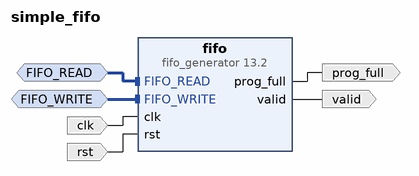
[diagram p0: block diagram of the top level]
# Vivado block design simple_fifo, xc7a35ticsg324-1L, Vivado 2020.1
create_bd_design simple_fifo

create_bd_intf_port -mode Slave -vlnv xilinx.com:interface:fifo_write_rtl:1.0 FIFO_WRITE
create_bd_intf_port -mode Slave -vlnv xilinx.com:interface:fifo_read_rtl:1.0 FIFO_READ
create_bd_port -dir I -type clk clk
set_property -dict {CONFIG.FREQ_HZ 100000000} [get_bd_ports clk]
create_bd_port -dir I rst
create_bd_port -dir O valid
create_bd_port -dir O prog_full

create_bd_cell -type ip -vlnv xilinx.com:ip:fifo_generator:13.2 fifo
set_property -dict [list \
  CONFIG.Fifo_Implementation Common_Clock_Builtin_FIFO \
  CONFIG.Full_Threshold_Assert_Value 510 \
  CONFIG.Input_Data_Width 64 \
  CONFIG.Input_Depth 512 \
  CONFIG.Programmable_Full_Type Single_Programmable_Full_Threshold_Constant \
  CONFIG.Valid_Flag true \
] [get_bd_cells fifo]

# ---- connections ----

connect_bd_intf_net [get_bd_intf_ports FIFO_READ] [get_bd_intf_pins fifo/FIFO_READ]
connect_bd_intf_net [get_bd_intf_ports FIFO_WRITE] [get_bd_intf_pins fifo/FIFO_WRITE]
connect_bd_net [get_bd_ports clk] [get_bd_pins fifo/clk]
connect_bd_net [get_bd_ports rst] [get_bd_pins fifo/rst]
connect_bd_net -net fifo_generator_0_valid [get_bd_pins fifo/valid] [get_bd_ports valid]
connect_bd_net -net fifo_generator_0_prog_full [get_bd_pins fifo/prog_full] [get_bd_ports prog_full]

validate_bd_design
save_bd_design
